# EAGLE design max30105-breakout (EAGLE 9.6.2)
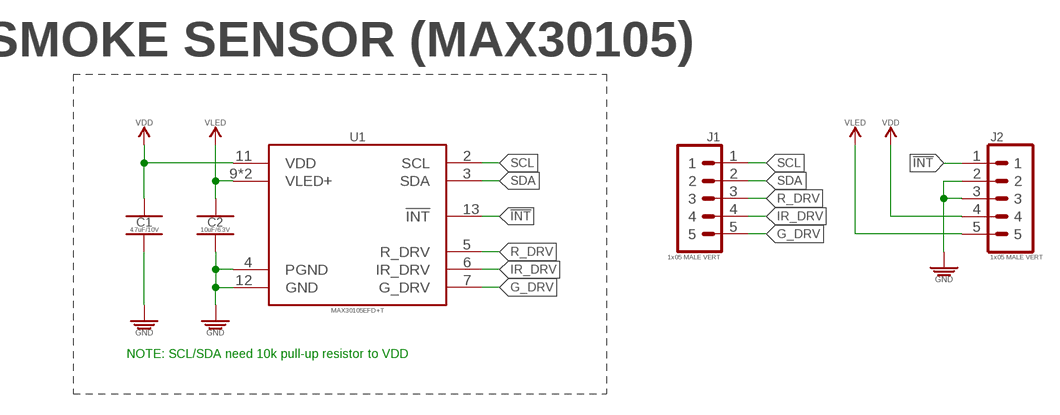
[diagram p0: schematic, sheet 1]

## Parts
C1  4.7uF/10V  4.7UF_CER_SMD-0402_10V-20%  [CAPC1005X55_SMD-0402]
C2  10uF/6.3V  10UF_CER_SMD-0402_6.3V-20%  [CAPC1005X55_SMD-0402]
J1  1x05 MALE VERT  1X05_PTH_VERT_MALE_2.54MM  [HDRV5W64P254_1X5_1270X254X838B]
J2  1x05 MALE VERT  1X05_PTH_VERT_MALE_2.54MM  [HDRV5W64P254_1X5_1270X254X838B]
U1  MAX30105EFD+T  [SON80P330X560X165-14N]

## Nets
!INT!: J2.1 U1.13(!INT!)
G_DRV: J1.5 U1.7(G_DRV)
GND: C1.2 C2.2 J2.2 J2.3 U1.4(PGND) U1.12(GND)
IR_DRV: J1.4 U1.6(IR_DRV)
R_DRV: J1.3 U1.5(R_DRV)
SCL: J1.1 U1.2(SCL)
SDA: J1.2 U1.3(SDA)
VDD: C1.1 J2.4 U1.11(VDD)
VLED: C2.1 J2.5 U1.9(VLED+) U1.10(VLED+)

## Notes on the sheet
- SMOKE SENSOR (MAX30105)
- NOTE: SCL/SDA need 10k pull-up resistor to VDD

## Library data of the parts
C1 = _capacitors:4.7UF; DATASHEET: http://www.samsungsem.com/kr/support/product-search/mlcc/CL05A475MP5NRNC.jsp; DIST: Digikey; DISTLINK: https://www.digikey.com/products/en?keywords=1276-1482-1-ND; DISTPN: 1276-1482-1-ND; MFR: Samsung Electro-Mechanics; MPN: CL05A475MP5NRNC
C2 = _capacitors:10UF; DATASHEET: https://www.murata.com/~/media/webrenewal/support/library/catalog/products/capacitor/mlcc/c02e.ashx; DIST: Digikey; DISTLINK: https://www.digikey.com/products/en?keywords=490-13233-1-ND; DISTPN: 490-13233-1-ND; MFR: Murata Electronics North America; MPN: GRM155C80J106ME11D
J1 J2 = _connectors:1X05; DATASHEET: https://s3.amazonaws.com/catalogspreads-pdf/PAGE112-113%20.100%20MALE%20HDR.pdf; DIST: Digikey; DISTLINK: https://www.digikey.com/en/products/detail/sullins-connector-solutions/PEC05SAAN/859158?s=N4IgTCBcDaIMoEYAMCwFEC0SCsGByAIiALoC%2BQA; DISTPN: S1012E-05-ND; MFR: Sullins Connector Solutions; MPN: PEC05SAAN
U1 = _sensors:MAX30105; DATASHEET: https://datasheets.maximintegrated.com/en/ds/MAX30105.pdf; DIST: Digikey; DISTLINK: https://www.digikey.com/en/products/detail/maxim-integrated/MAX30105EFD-T/6188726?s=N4IgTCBcDaILIEEAaBmADARjQVgKIDEARAagBUBhUgWgDlCQBdAXyA; DISTPN: MAX30105EFD+TCT-ND; MFR: Maxim Integrated; MPN: MAX30105EFD+T

## Board
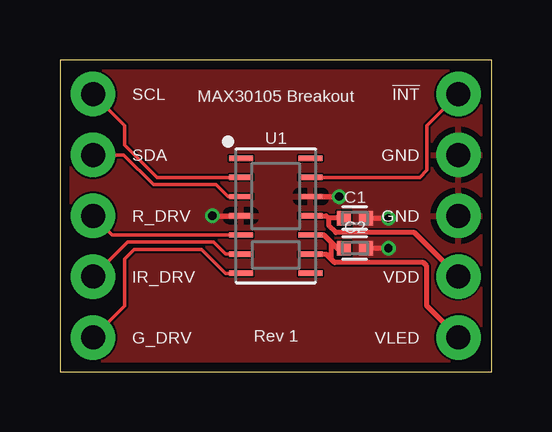
[diagram p1: board, top side]
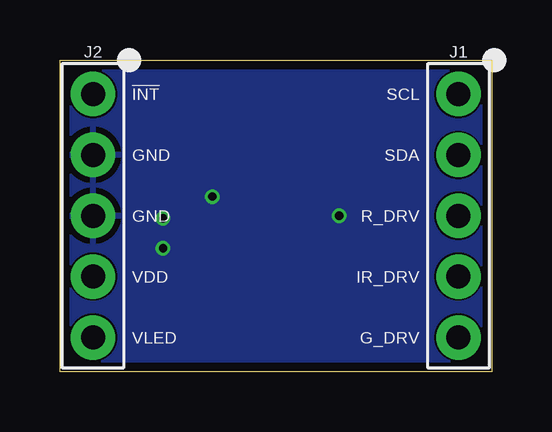
[diagram p2: board, bottom side, seen from below]

Size 18 x 13 mm. Coordinates in mm from the lower left corner, seen from the top.
Outline: 0,0 18,0 18,13 0,13 0,0
Copper layers (1*16): Top 0.035559375mm / dielectric 1.6mm / Bottom 0.035559375mm
Design rules "stella-wearables": minimum track width 3mil, minimum drill 6mil, track to track 3mil, track to pad 3mil, pad to pad 3mil, via to via 3mil, smd to smd 3mil, copper to edge 15mil, drill to drill 6mil, minimum pad ring 5mil, minimum via ring 5mil, stop-mask expansion 2.5mil, vias tented up to drill 0mil, thermal gap 10mil

### Footprints (pad centres in the part's own frame; a part is rotated, then mirrored left to right if it is on the bottom)
CAPC1005X55_SMD-0402 = smd 0.585 x 0.612: 1 -0.458,0; 2 0.458,0
HDRV5W64P254_1X5_1270X254X838B = drill 1 pad 1.85: 1 -5.08,0; 2 -2.54,0; 3 0,0; 4 2.54,0; 5 5.08,0
SON80P330X560X165-14N = smd 1 x 0.22: 1 -1.45,2.4; 2 -1.45,1.6; 3 -1.45,0.8; 4 -1.45,0; 5 -1.45,-0.8; 6 -1.45,-1.6; 7 -1.45,-2.4; 8 1.45,-2.4; 9 1.45,-1.6; 10 1.45,-0.8; 11 1.45,0; 12 1.45,0.8; 13 1.45,1.6; 14 1.45,2.4

### Placement (x,y rotation side)
C1  12.3,6.4 0 top
C2  12.3,5.15 0 top
J1  1.38,6.5 270 bottom
J2  16.62,6.5 270 bottom
U1  9,6.5 0 top

### Tracks (layer width: path | path; a pad name or v marks a point on that pad's centre or on a via)
!INT!
  Top 0.152: J2.1 15.3,10.26 15.3,8.4 15,8.1 U1.13
G_DRV
  Top 0.152: J1.5 2.7,2.74 2.7,3.8 2.7,4.7 3.1,5.1 5.9,5.1 6.9,4.1 U1.7
GND  (via drill 0.35 pad 0.15)
  Top 0.203: U1.12 v11.65,7.3 | v6.35,6.5 7.7,6.5 | C2.2 v13.7,5.15 | C1.2 v13.7,6.4
  pour Bottom: 0,0 18,0 18,13 0,13
  pour Top: 0,0 18,0 18,13 0,13
IR_DRV
  Top 0.152: U1.6 6.9,4.9 6.4,5.4 2.82,5.4 J1.4
R_DRV
  Top 0.152: J1.3 2.18,5.7 U1.5
SCL
  Top 0.152: U1.2 4.05,8.1 2.7,9.45 2.7,10.26 J1.1
SDA
  Top 0.152: J1.2 2.66,9.04 3.9,7.8 6.5,7.8 7,7.3 U1.3
VDD
  Top 0.203: U1.11 11.1,6.5 11.2,6.4 | 11.2,6.4 11.2,6.1 11.5,5.8 14.78,5.8 J2.4 | C1.1 11.2,6.4
VLED
  Top 0.203: U1.10 11,5.7 11.3,5.4 | 11.3,5.4 11.3,4.7 | 11.3,4.7 11.45,4.55 15.15,4.55 15.3,4.4 15.3,2.74 J2.5 | 11.3,5.4 11.55,5.15 C2.1 | U1.9 11.1,4.9 11.3,4.7

### Text on the board
tPlace: SCL | MAX30105 Breakout | !INT! | SDA | GND | R_DRV | GND | IR_DRV | VDD | G_DRV | Rev 1 | VLED
bPlace: SCL | !INT! | SDA | GND | R_DRV | GND | IR_DRV | VDD | G_DRV | VLED